# EAGLE design cp32m4 (EAGLE 9.2.1)
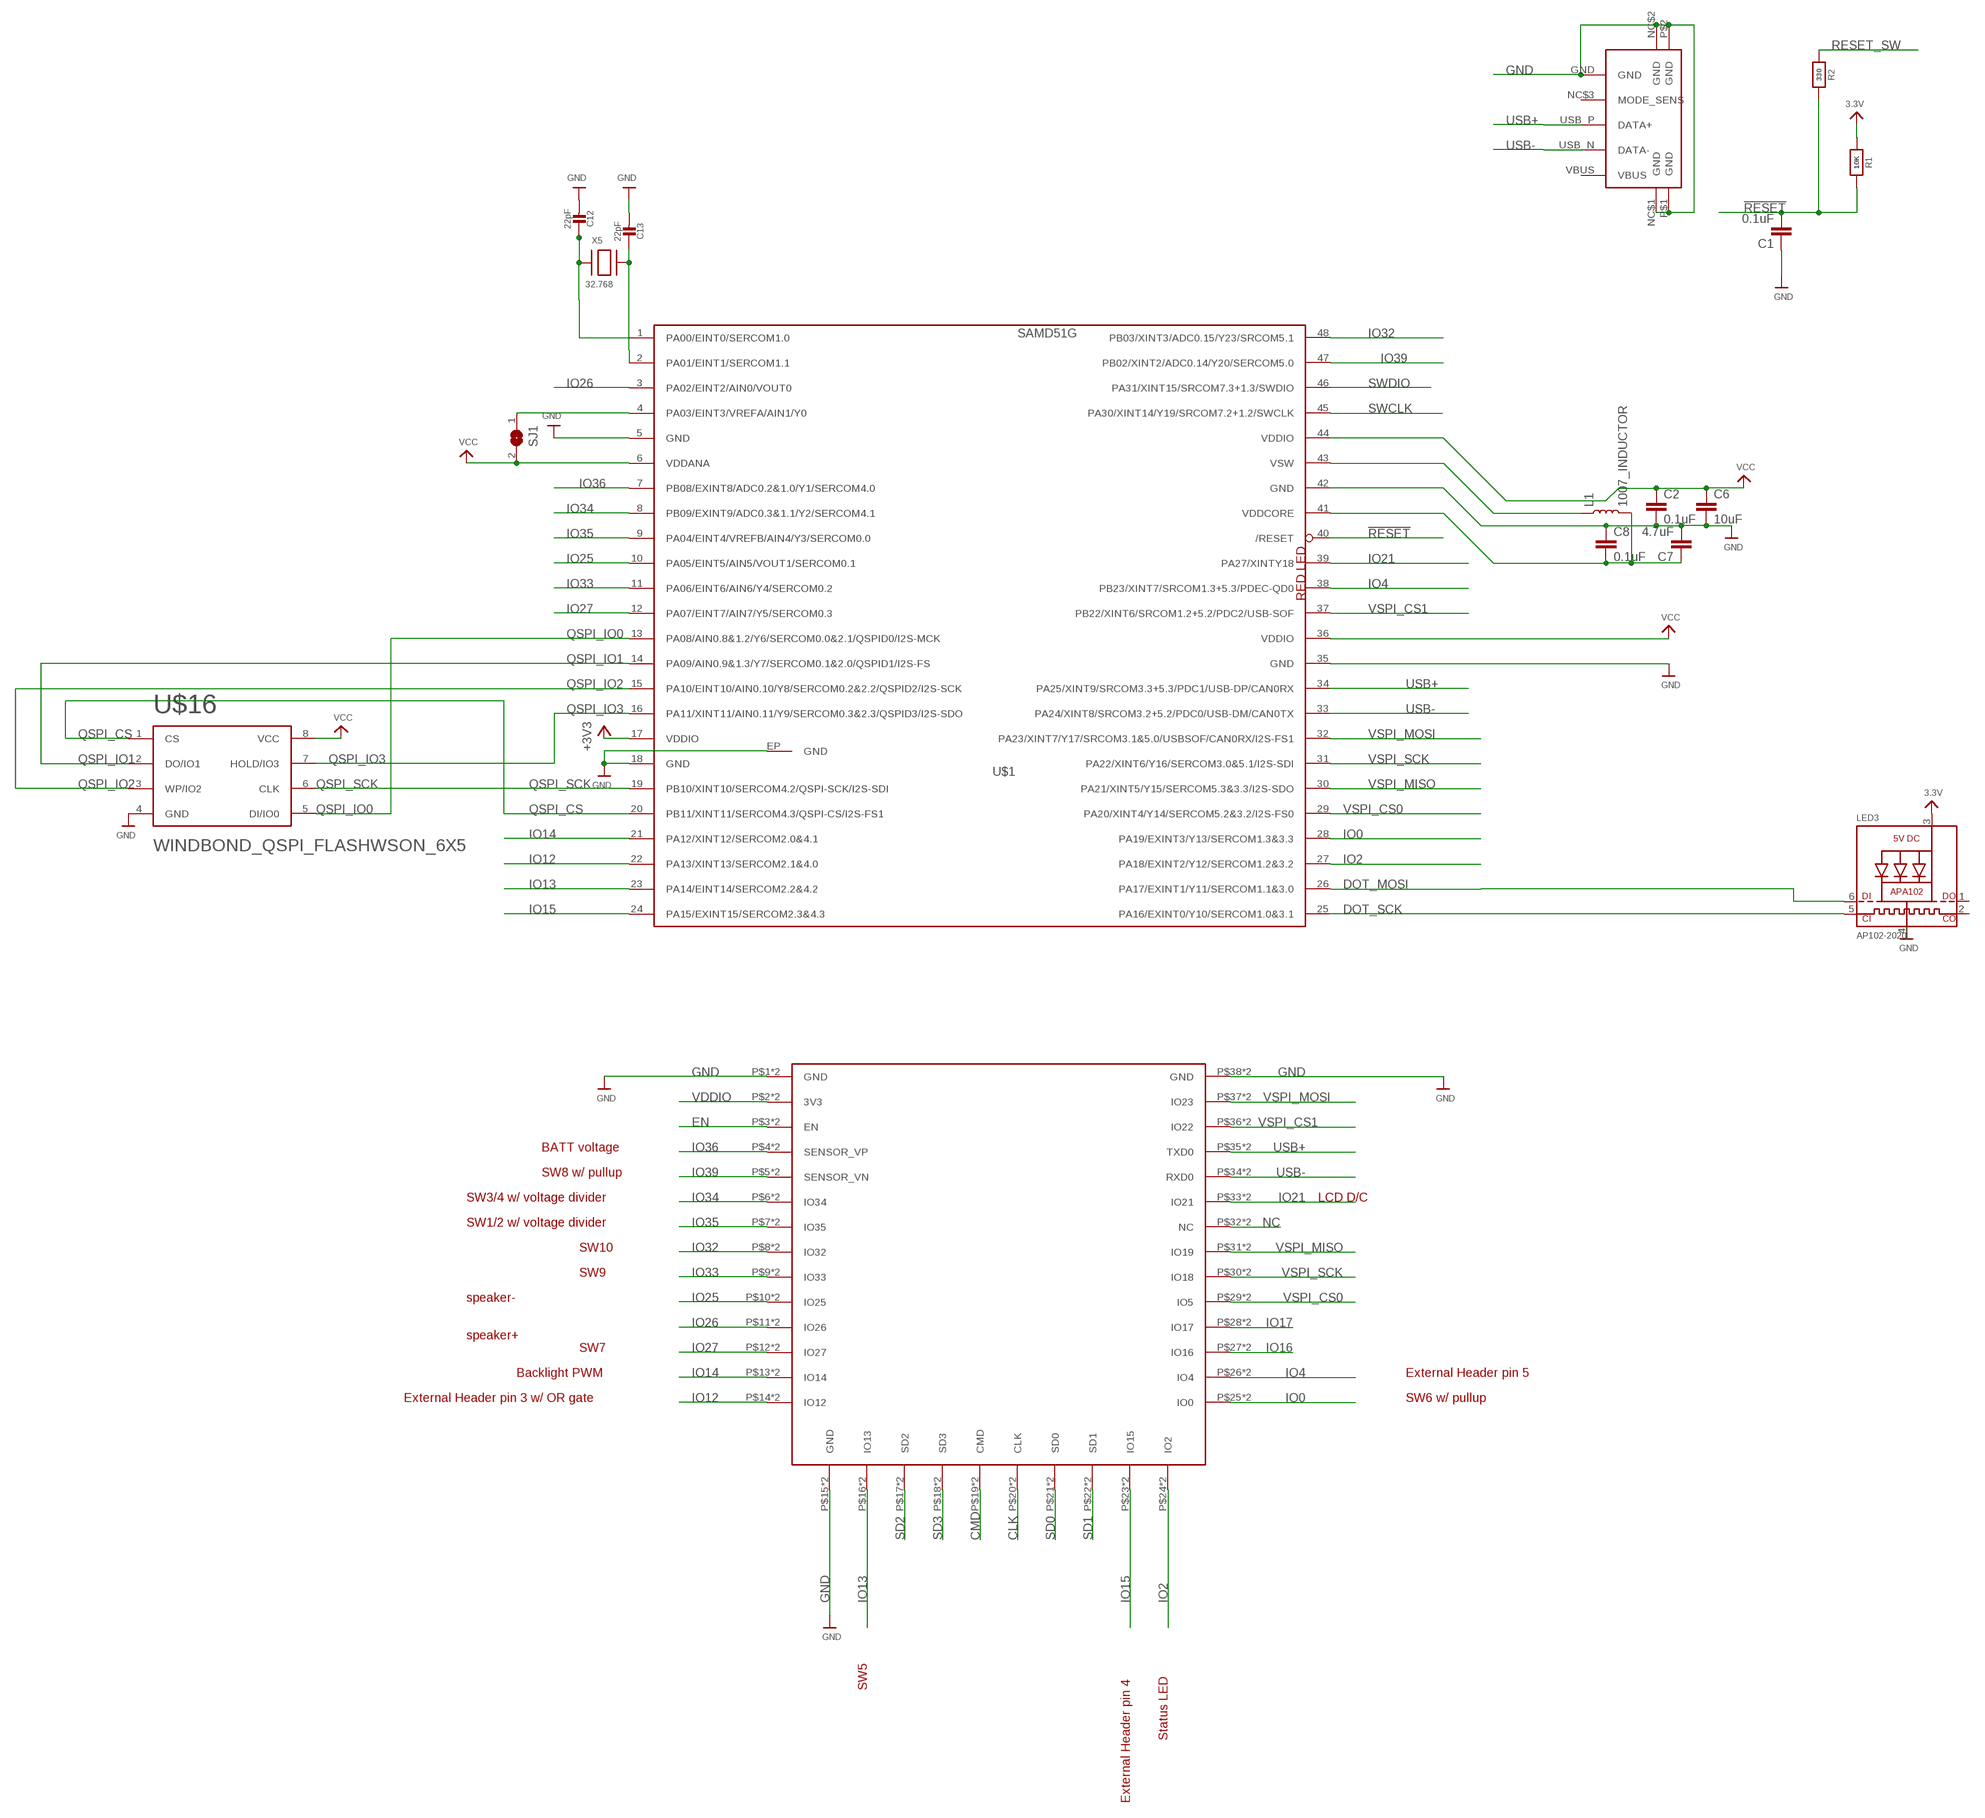
[diagram p0: schematic, sheet 1, part 1 of 2]
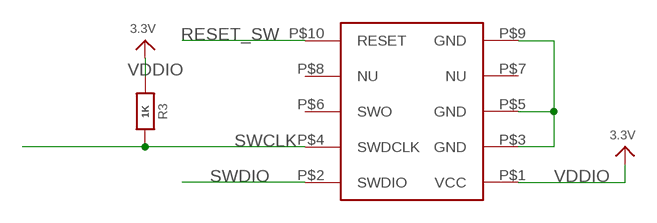
[diagram p1: schematic, sheet 1, part 2 of 2]

## Parts
C1  0.1uF  0.1UF-0603-25V-(+80/-20%)  [0603]
C2  0.1uF  0.1UF-0603-25V-(+80/-20%)  [0603]
C6  10uF  10UF-0805-10V-10%  [0805]
C7  4.7uF  4.7UF0603  [0603]
C8  0.1uF  0.1UF-0603-25V-(+80/-20%)  [0603]
C12  22pF  CAP_CERAMIC0603_NO  [0603-NO]
C13  22pF  CAP_CERAMIC0603_NO  [0603-NO]
L1  1007_INDUCTOR  [1007_INDUCTOR]
LED3  AP102-2020  APA1022020  [APA102_2020]
R1  10K  RESISTOR_0603_NOOUT  [0603-NO]
R2  330  RESISTOR_0603_NOOUT  [0603-NO]
R3  1K  RESISTOR_0603_NOOUT  [0603-NO]
SJ1  SOLDERJUMPERCLOSED  [SOLDERJUMPER_CLOSEDWIRE]
U$1  SAMD51G  [QFN-48]
U$2  SWD_HEADER  [AMPHENOL_SWD]
U$5  WROOM  [ESP32_WROOM]
U$16  WINDBOND_QSPI_FLASHWSON_6X5  [WSON_6X5MM]
U$19  AMPHENOL_MICRO_USBAMPHENOL_MICRO_USB_BETTER  [BETTER_AMP_MICRO_USB]
X5  32.768  XTAL-3.2X1.5  [XTAL3215]

## Nets
!RESET: C1.2 R1.1 R2.1 U$1.40(/RESET)
AREF: SJ1.1 U$1.4(PA03/EINT3/VREFA/AIN1/Y0)
CLK: U$5.P$20(CLK) U$5.PP$20(CLK)
CMD: U$5.P$19(CMD) U$5.PP$19(CMD)
DOT_MOSI: LED3.6(DI) U$1.26(PA17/EXINT1/Y11/SERCOM1.1&3.0)
DOT_SCK: LED3.5(CKI) U$1.25(PA16/EXINT0/Y10/SERCOM1.0&3.1)
EN: U$5.P$3(EN) U$5.PP$3(EN)
GND: C1.1 C2.2 C6.2 C7.2 C8.1 C12.2 C13.2 LED3.4(GND) U$1.5(GND) U$1.18(GND) U$1.35(GND) U$1.42(GND) U$1.EP(GND) U$2.P$3(GND) U$2.P$5(GND) U$2.P$9(GND) U$5.P$1(GND) U$5.P$15(GND) U$5.P$38(GND) U$5.PP$1(GND) U$5.PP$15(GND) U$5.PP$38(GND) U$16.4(GND) U$19.GND U$19.NC$1(GND) U$19.NC$2(GND) U$19.P$1(GND) U$19.P$2(GND)
IO0: U$1.28(PA19/EXINT3/Y13/SERCOM1.3&3.3) U$5.P$25(IO0) U$5.PP$25(IO0)
IO2: U$1.27(PA18/EXINT2/Y12/SERCOM1.2&3.2) U$5.P$24(IO2) U$5.PP$24(IO2)
IO4: U$1.38(PB23/XINT7/SRCOM1.3+5.3/PDEC-QD0) U$5.P$26(IO4) U$5.PP$26(IO4)
IO12: U$1.22(PA13/XINT13/SERCOM2.1&4.0) U$5.P$14(IO12) U$5.PP$14(IO12)
IO13: U$1.23(PA14/EINT14/SERCOM2.2&4.2) U$5.P$16(IO13) U$5.PP$16(IO13)
IO14: U$1.21(PA12/XINT12/SERCOM2.0&4.1) U$5.P$13(IO14) U$5.PP$13(IO14)
IO15: U$1.24(PA15/EXINT15/SERCOM2.3&4.3) U$5.P$23(IO15) U$5.PP$23(IO15)
IO16: U$5.P$27(IO16) U$5.PP$27(IO16)
IO17: U$5.P$28(IO17) U$5.PP$28(IO17)
IO21: U$1.39(PA27/XINTY18) U$5.P$33(IO21) U$5.PP$33(IO21)
IO25: U$1.10(PA05/EINT5/AIN5/VOUT1/SERCOM0.1) U$5.P$10(IO25) U$5.PP$10(IO25)
IO26: U$1.3(PA02/EINT2/AIN0/VOUT0) U$5.P$11(IO26) U$5.PP$11(IO26)
IO27: U$1.12(PA07/EINT7/AIN7/Y5/SERCOM0.3) U$5.P$12(IO27) U$5.PP$12(IO27)
IO32: U$1.48(PB03/XINT3/ADC0.15/Y23/SRCOM5.1) U$5.P$8(IO32) U$5.PP$8(IO32)
IO33: U$1.11(PA06/EINT6/AIN6/Y4/SERCOM0.2) U$5.P$9(IO33) U$5.PP$9(IO33)
IO34: U$1.8(PB09/EXINT9/ADC0.3&1.1/Y2/SERCOM4.1) U$5.P$6(IO34) U$5.PP$6(IO34)
IO35: U$1.9(PA04/EINT4/VREFB/AIN4/Y3/SERCOM0.0) U$5.P$7(IO35) U$5.PP$7(IO35)
IO36: U$1.7(PB08/EXINT8/ADC0.2&1.0/Y1/SERCOM4.0) U$5.P$4(SENSOR_VP) U$5.PP$4(SENSOR_VP)
IO39: U$1.47(PB02/XINT2/ADC0.14/Y20/SERCOM5.0) U$5.P$5(SENSOR_VN) U$5.PP$5(SENSOR_VN)
NC: U$5.P$32(NC) U$5.PP$32(NC)
QSPI_CS: U$1.20(PB11/XINT11/SERCOM4.3/QSPI-CS/I2S-FS1) U$16.1(CS)
QSPI_IO0: U$1.13(PA08/AIN0.8&1.2/Y6/SERCOM0.0&2.1/QSPID0/I2S-MCK) U$16.5(DI/IO0)
QSPI_IO1: U$1.14(PA09/AIN0.9&1.3/Y7/SERCOM0.1&2.0/QSPID1/I2S-FS) U$16.2(DO/IO1)
QSPI_IO2: U$1.15(PA10/EINT10/AIN0.10/Y8/SERCOM0.2&2.2/QSPID2/I2S-SCK) U$16.3(WP/IO2)
QSPI_IO3: U$1.16(PA11/XINT11/AIN0.11/Y9/SERCOM0.3&2.3/QSPID3/I2S-SDO) U$16.7(HOLD/IO3)
QSPI_SCK: U$1.19(PB10/XINT10/SERCOM4.2/QSPI-SCK/I2S-SDI) U$16.6(CLK)
RESET_SW: R2.2 U$2.P$10(RESET)
SD0: U$5.P$21(SD0) U$5.PP$21(SD0)
SD1: U$5.P$22(SD1) U$5.PP$22(SD1)
SD2: U$5.P$17(SD2) U$5.PP$17(SD2)
SD3: U$5.P$18(SD3) U$5.PP$18(SD3)
SWCLK: R3.1 U$1.45(PA30/XINT14/Y19/SRCOM7.2+1.2/SWCLK) U$2.P$4(SWDCLK)
SWDIO: U$1.46(PA31/XINT15/SRCOM7.3+1.3/SWDIO) U$2.P$2(SWDIO)
USB+: U$1.34(PA25/XINT9/SRCOM3.3+5.3/PDC1/USB-DP/CAN0RX) U$5.P$35(TXD0) U$5.PP$35(TXD0) U$19.USB_P(DATA+)
USB-: U$1.33(PA24/XINT8/SRCOM3.2+5.2/PDC0/USB-DM/CAN0TX) U$5.P$34(RXD0) U$5.PP$34(RXD0) U$19.USB_N(DATA-)
VDDCORE: C7.1 C8.2 L1.P$2 U$1.41(VDDCORE)
VDDIO: C2.1 C6.1 LED3.3(VDD) R1.2 R3.2 SJ1.2 U$1.6(VDDANA) U$1.17(VDDIO) U$1.36(VDDIO) U$1.44(VDDIO) U$2.P$1(VCC) U$5.P$2(3V3) U$5.PP$2(3V3) U$16.8(VCC) ; supply symbol labelled VCC, 3.3V, +3V3
VSPI_CS0: U$1.29(PA20/XINT4/Y14/SERCOM5.2&3.2/I2S-FS0) U$5.P$29(IO5) U$5.PP$29(IO5)
VSPI_CS1: U$1.37(PB22/XINT6/SRCOM1.2+5.2/PDC2/USB-SOF) U$5.P$36(IO22) U$5.PP$36(IO22)
VSPI_MISO: U$1.30(PA21/XINT5/Y15/SERCOM5.3&3.3/I2S-SDO) U$5.P$31(IO19) U$5.PP$31(IO19)
VSPI_MOSI: U$1.32(PA23/XINT7/Y17/SRCOM3.1&5.0/USBSOF/CAN0RX/I2S-FS1) U$5.P$37(IO23) U$5.PP$37(IO23)
VSPI_SCK: U$1.31(PA22/XINT6/Y16/SERCOM3.0&5.1/I2S-SDI) U$5.P$30(IO18) U$5.PP$30(IO18)
VSW: L1.P$1 U$1.43(VSW)
XOSC32_A: C12.1 U$1.1(PA00/EINT0/SERCOM1.0) X5.P$1
XOSC32_B: C13.1 U$1.2(PA01/EINT1/SERCOM1.1) X5.P$2
Unconnected: LED3.1(DO) LED3.2(CKO) U$2.P$6(SWO) U$2.P$7(NU) U$2.P$8(NU) U$19.NC$3(MODE_SENS) U$19.VBUS

## Notes on the sheet
- Dev Board Starter Kit
- RED LED
- BATT voltage
- SW8 w/ pullup
- SW3/4 w/ voltage divider | LCD D/C
- SW1/2 w/ voltage divider
- SW10
- SW9
- speaker-
- speaker+
- SW7
- Backlight PWM | External Header pin 5
- External Header pin 3 w/ OR gate | SW6 w/ pullup
- SW5
- Status LED
- External Header pin 4

## Library data of the parts
C1 C2 C8 = SparkFun-Capacitors:0.1UF: 0.1µF ceramic capacitors A capacitor is a passive two-terminal electrical component used to store electrical energy temporarily in an electric field.; PROD_ID: CAP-00810
C6 = SparkFun-Capacitors:10UF: 10.0µF ceramic capacitors A capacitor is a passive two-terminal electrical component used to store electrical energy temporarily in an electric field.; PROD_ID: CAP-11330
C7 = SparkFun-Capacitors:4.7UF: 4.7µF ceramic capacitors A capacitor is a passive two-terminal electrical component used to store electrical energy temporarily in an electric field.; PROD_ID: CAP-08280
C12 C13 = microbuilder:CAP_CERAMIC: Ceramic Capacitors For new designs, use the packages preceded by an '_' character since they are more reliable: The following footprints should be used on most boards: _0402 - Standard footprint for regular board layouts _0603 - Standard footprint for regular board layouts _0805 - Standard footprint for regular board layouts _1206 - Standard footprint for regular board layouts For extremely tight-pitch boards where space is at a premium, the following 'micro-pitch' footprints can be used (smaller pads, no silkscreen outline, etc.): _0402MP - Micro-pitch footprint for very dense/compact boards _0603MP - Micro-pitch footprint for very dense/compact boards _0805MP - Micro-pitch footprint for very dense/compact boards _1206MP - Micro-pitch footprint for very dense/compact boards
L1 = 00_bsiepert:1007_INDUCTOR
LED3 = microbuilder:APA102: APA102/DotStar Pixels VCC: 5V DC Refresh Rate: 400Hz
R1-R3 = microbuilder:RESISTOR: Resistors For new designs, use the packages preceded by an '_' character since they are more reliable: The following footprints should be used on most boards: _0402 - Standard footprint for regular board layouts _0603 - Standard footprint for regular board layouts _0805 - Standard footprint for regular board layouts _1206 - Standard footprint for regular board layouts For extremely tight-pitch boards where space is at a premium, the following 'micro-pitch' footprints can be used (smaller pads, no silkscreen outline, etc.): _0402MP - Micro-pitch footprint for very dense/compact boards _0603MP - Micro-pitch footprint for very dense/compact boards _0805MP - Micro-pitch footprint for very dense/compact boards _1206MP - Micro-pitch footprint for very dense/compact boards
SJ1 = 00_bsiepert:SOLDERJUMPER: SMD Solder JUMPER Solder the two pads together to create a connection, or remove the solder to break it. REFLOW - Use this footprint for solder paste and reflow ovens. WAVE - Use this footprint for hand-soldering (larger pads). CLOSED - Has a trace between the two pads to ensure it is closed by default. The trace needs to be cut to disable the jumper, and can be closed again by creating a solder bridge between the two pads.
U$1 = 00_bsiepert:SAMD51G
U$2 = 00_bsiepert:SWD_HEADER
U$5 = 00_bsiepert:WROOM
U$16 = 00_bsiepert:WINDBOND_QSPI_FLASH
U$19 = 00_bsiepert:AMPHENOL_MICRO_USB
X5 = adafruit2:XTAL: Low cost SMT crystals, no capacitors included http://www.ladyada.net/library/eagle

## Board
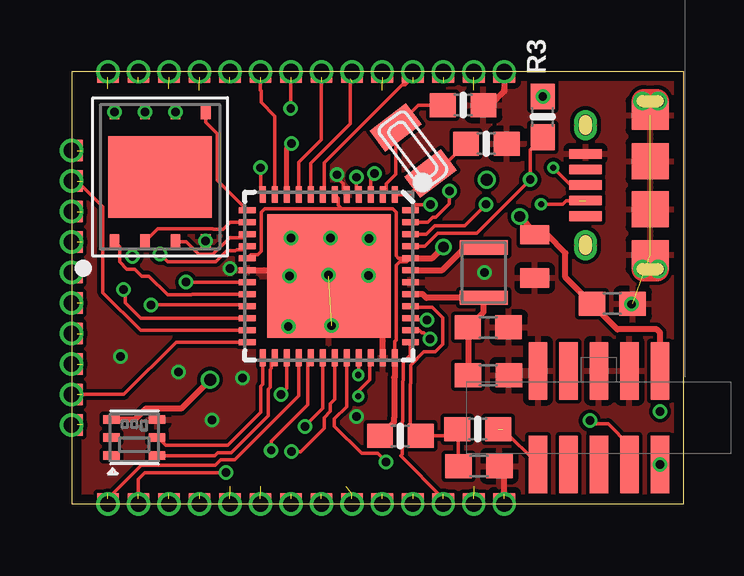
[diagram p2: board, top side]
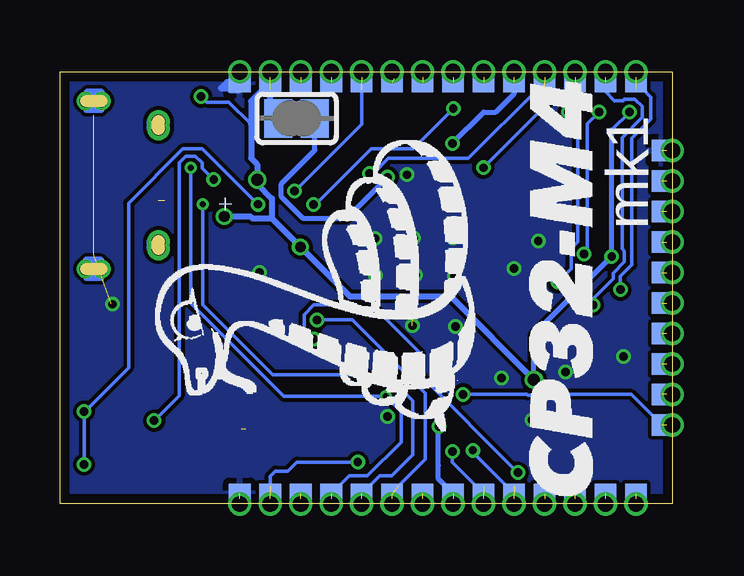
[diagram p3: board, bottom side, seen from below]

Size 25.51 x 18 mm. Coordinates in mm from the lower left corner, seen from the top.
Outline: 0,16.6 0,12.03
Copper layers (1*16): Top 0.035559375mm / dielectric 1.6mm / Bottom 0.035559375mm
Design rules "oshpark-2layer-tented": minimum track width 6mil, minimum drill 10mil, track to track 6mil, track to pad 6mil, pad to pad 6mil, via to via 6mil, smd to smd 6mil, copper to edge 15mil, drill to drill 6mil, minimum pad ring 5mil, minimum via ring 5mil, stop-mask expansion 2.5mil, vias tented up to drill 20mil, thermal gap 10mil

### Footprints (pad centres in the part's own frame; a part is rotated, then mirrored left to right if it is on the bottom)
0603 = smd 1.1 x 1: 1 -0.85,0; 2 0.85,0
0805 = smd 0.8 x 1.2: 1 -0.9,0; 2 0.9,0
0603-NO = smd 1.075 x 1: 1 -0.85,0; 2 0.85,0
1007_INDUCTOR = smd 0.6 x 2: P$1 -1.05,0; P$2 1.05,0
APA102_2020 = smd 0.7 x 0.35: 1 -0.95,-0.75; 2 -0.95,0; 3 -0.95,0.75; 4 0.95,0.75; 5 0.95,0; 6 0.95,-0.75
SOLDERJUMPER_CLOSEDWIRE = smd 1.168 x 1.6: 1 -0.762,0; 2 0.762,0 | smd 0.635 x 0.203: WIRE 0,0
QFN-48 = smd 0.7 x 0.25: 1 -3.4,2.75; 2 -3.4,2.25; 3 -3.4,1.75; 4 -3.4,1.25; 5 -3.4,0.75; 6 -3.4,0.25; 7 -3.4,-0.25; 8 -3.4,-0.75; 9 -3.4,-1.25; 10 -3.4,-1.75; 11 -3.4,-2.25; 12 -3.4,-2.75; 25 3.4,-2.75; 26 3.4,-2.25; 27 3.4,-1.75; 28 3.4,-1.25; 29 3.4,-0.75; 30 3.4,-0.25; 31 3.4,0.25; 32 3.4,0.75; 33 3.4,1.25; 34 3.4,1.75; 35 3.4,2.25; 36 3.4,2.75 | smd 0.25 x 0.7: 13 -2.75,-3.4; 14 -2.25,-3.4; 15 -1.75,-3.4; 16 -1.25,-3.4; 17 -0.75,-3.4; 18 -0.25,-3.4; 19 0.25,-3.4; 20 0.75,-3.4; 21 1.25,-3.4; 22 1.75,-3.4; 23 2.25,-3.4; 24 2.75,-3.4; 37 2.75,3.4; 38 2.25,3.4; 39 1.75,3.4; 40 1.25,3.4; 41 0.75,3.4; 42 0.25,3.4; 43 -0.25,3.4; 44 -0.75,3.4; 45 -1.25,3.4; 46 -1.75,3.4; 47 -2.25,3.4; 48 -2.75,3.4 | smd 5.15 x 5.15: EP 0,0
AMPHENOL_SWD = smd 0.76 x 2.4: P$1 -2.54,-1.95; P$2 -2.54,1.95; P$3 -1.27,-1.95; P$4 -1.27,1.95; P$5 0,-1.95; P$6 0,1.95; P$7 1.27,-1.95; P$8 1.27,1.95; P$9 2.54,-1.95; P$10 2.54,1.95
ESP32_WROOM = smd 0.45 x 0.9: P$1 -8.775,9.01; P$2 -8.775,7.74; P$3 -8.775,6.47; P$4 -8.775,5.2; P$5 -8.775,3.93; P$6 -8.775,2.66; P$7 -8.775,1.39; P$8 -8.775,0.12; P$9 -8.775,-1.15; P$10 -8.775,-2.42; P$11 -8.775,-3.69; P$12 -8.775,-4.96; P$13 -8.775,-6.23; P$14 -8.775,-7.5; P$25 8.775,-7.5; P$26 8.775,-6.23; P$27 8.775,-4.96; P$28 8.775,-3.69; P$29 8.775,-2.42; P$30 8.775,-1.15; P$31 8.775,0.12; P$32 8.775,1.39; P$33 8.775,2.66; P$34 8.775,3.93; P$35 8.775,5.2; P$36 8.775,6.47; P$37 8.775,7.74; P$38 8.775,9.01 | smd 0.9 x 0.45: P$15 -5.72,-8.775; P$16 -4.45,-8.775; P$17 -3.18,-8.775; P$18 -1.91,-8.775; P$19 -0.64,-8.775; P$20 0.63,-8.775; P$21 1.9,-8.775; P$22 3.17,-8.775; P$23 4.44,-8.775; P$24 5.71,-8.775 | drill 0.65 pad 0.904: P$39 -9.009,9.01; P$40 -9.009,7.74; P$41 -9.009,6.47; P$42 -9.009,5.2; P$43 -9.009,3.93; P$44 -9.009,2.66; P$45 -9.009,1.39; P$46 -9.009,0.12; P$47 -9.009,-1.15; P$48 -9.009,-2.42; P$49 -9.009,-3.69; P$50 -9.009,-4.96; P$51 -9.009,-6.23; P$52 -9.009,-7.5; P$53 -5.72,-9.011; P$54 -4.45,-9.011; P$55 -3.18,-9.011; P$56 -1.91,-9.011; P$57 -0.64,-9.011; P$58 0.63,-9.011; P$59 1.9,-9.011; P$60 3.17,-9.011; P$61 4.44,-9.011; P$62 5.71,-9.011; P$63 9.009,-7.5; P$64 9.009,-6.23; P$65 9.009,-4.96; P$66 9.009,-3.69; P$67 9.009,-2.42; P$68 9.009,-1.15; P$69 9.009,0.12; P$70 9.009,1.39; P$71 9.009,2.66; P$72 9.009,3.93; P$73 9.009,5.2; P$74 9.009,6.47; P$75 9.009,7.74; P$76 9.009,9.01 | smd 0.85 x 0.9 bottom: PP$1 -8.575,9.01; PP$2 -8.575,7.74; PP$3 -8.575,6.47; PP$4 -8.575,5.2; PP$5 -8.575,3.93; PP$6 -8.575,2.66; PP$7 -8.575,1.39; PP$8 -8.575,0.12; PP$9 -8.575,-1.15; PP$10 -8.575,-2.42; PP$11 -8.575,-3.69; PP$12 -8.575,-4.96; PP$13 -8.575,-6.23; PP$14 -8.575,-7.5; PP$25 8.575,-7.5; PP$26 8.575,-6.23; PP$27 8.575,-4.96; PP$28 8.575,-3.69; PP$29 8.575,-2.42; PP$30 8.575,-1.15; PP$31 8.575,0.12; PP$32 8.575,1.39; PP$33 8.575,2.66; PP$34 8.575,3.93; PP$35 8.575,5.2; PP$36 8.575,6.47; PP$37 8.575,7.74; PP$38 8.575,9.01 | smd 0.9 x 0.85 bottom: PP$15 -5.72,-8.575; PP$16 -4.45,-8.575; PP$17 -3.18,-8.575; PP$18 -1.91,-8.575; PP$19 -0.64,-8.575; PP$20 0.63,-8.575; PP$21 1.9,-8.575; PP$22 3.17,-8.575; PP$23 4.44,-8.575; PP$24 5.71,-8.575
WSON_6X5MM = smd 0.6 x 0.4: 1 -2.7,1.905; 2 -2.7,0.635; 3 -2.7,-0.635; 4 -2.7,-1.905; 5 2.7,-1.905; 6 2.7,-0.635; 7 2.7,0.635; 8 2.7,1.905 | smd 3.4 x 4.3: PAD 0,0
BETTER_AMP_MICRO_USB = smd 0.4 x 1.35: GND 1.3,2.7; NC$3 0.65,2.7; USB_N -0.65,2.7; USB_P 0,2.7; VBUS -1.3,2.7 | smd 1.5 x 1.55: NC$1 -1,0; NC$2 1,0 | smd 1.2 x 1.55: P$1 -2.9,0; P$2 2.9,0 | drill 0.5: P$3 -3.5,0.325; P$4 -3.5,-0.325; P$5 3.5,-0.325; P$6 3.5,0.325 | drill 0.55 pad 0.95: P$7 -2.65,2.7; P$8 -2.35,2.7; P$9 2.35,2.7; P$10 2.65,2.7
XTAL3215 = smd 1.1 x 1.9: P$1 1.2,0; P$2 -1.2,0

### Placement (x,y rotation side)
C1  16.98,1.58 180 top
C2  22.53,8.34 0 top
C6  19.3,10.31 270 top
C7  17.36,7.35 0 top
C8  17.37,5.37 180 top
C12  17.28,15.01 0 top
C13  16.31,16.62 0 top
L1  17.16,9.64 270 top
LED3  2.61,2.77 0 top
R1  13.7,2.83 180 top
R2  16.92,3.12 0 top
R3  19.63,16.12 90 top
SJ1  15.66,16.06 180 bottom
U$1  10.72,9.49 270 top
U$2  21.97,3.59 180 top
U$5  9.01,9 270 top
U$16  3.69,13.63 90 top
U$19  24.11,13.29 90 top
X5  14.23,14.73 307 top

### Tracks (layer width: path | path; a pad name or v marks a point on that pad's centre or on a via)
!RESET  (1 unrouted)
  Top 0.152: C1.2 16.11,1.56 16.11,3.08 R2.1 | 15.87,3.32 R2.1 | 14.16,8.2 15.03,8.2 15.47,7.75 15.47,6.64 15.16,6.33 14.68,6.33 14.13,5.78 14.13,5.02 14.1,4.99 14.1,3.28 R1.1 15.78,2.83 R2.1 | 14.15,8.21 U$1.40
AREF  (via drill 0.35)
  Top 0.152: U$1.4 11.86,12.99 v11.86,13.61
  Bottom 0.203: SJ1.1 14.89,14.74 16.29,13.34 16.29,12.81 15.37,11.88 13.59,11.88 v11.86,13.61
CLK  (1 unrouted)
CMD  (1 unrouted)
DOT_MOSI
  Top 0.152: U$1.26 8.32,5.94 8.32,5.65 8.27,5.6 8.27,4.87 8.19,4.78 8.19,3.67 6.65,2.14 6.09,2.14 5.97,2.02 LED3.6
DOT_SCK
  Top 0.152: LED3.5 3.6,2.77 3.92,2.44 6.52,2.44 7.88,3.81 7.88,4.91 7.97,5 U$1.25
EN  (1 unrouted)
GND  (via drill 0.35)  (7 unrouted)
  Top 0.152: U$1.5 11.32,13.04 11.32,13.34 11.06,13.59 v11.06,13.72
  Top 0.254: 18.02,17.19 17.45,16.62 C13.2 | U$5.P$38 18.02,1.38 C1.1 | U$1.35 12.97,7.28 v10.71,9.54 10.51,9.74 U$1.18 | 18.02,17.19 18.02,17.24 18.02,17.19 | U$5.P$1 18.02,17.19
  Bottom 0.254: U$5.PP$1 18.55,17.57 18.8,17.32 18.81,17.32 18.51,17.32 18.43,17.24 18.02,17.24
  other vias: 5.85,3.5 9.14,11.08 10.78,11.07 12.39,11.07 12.38,9.52 9.08,9.49 9.03,7.4 10.83,7.43 2.03,6.13 4.45,5.5 7.11,5.25 6.6,9.81 5.59,10.96 11.87,3.65 17.2,9.65 23.34,8.32
  pour Top: 0.05,18.09 25.64,18.09 25.64,-0.16 0.05,-0.16
  pour Bottom: 26.24,18.75 26.24,-0.48 -0.66,-0.48 -0.66,18.74
IO0  (1 unrouted)
  Top 0.152: U$1.28 9.47,4.5 6.8,1.83 6.22,1.83 5.99,1.61 2.9,1.61 U$5.P$25
IO2  (via drill 0.35)  (1 unrouted)
  Top 0.152: v8.72,4.56 8.97,4.81 U$1.27
  Bottom 0.152: U$5.PP$24 1.71,4.56 5.47,4.56 5.5,4.54 6.03,4.54 6.06,4.56 v8.72,4.56
IO4  (via drill 0.35)  (1 unrouted)
  Top 0.152: U$5.P$26 2.78,1.03 3.06,1.3 v6.44,1.3 | U$1.38 14.48,7.24 14.59,7.14 14.67,7.14 v14.94,6.86
  Bottom 0.152: v6.44,1.3 10.49,5.36 10.49,6.01 10.49,6.26 12.32,8.09 13.23,8.09 13.42,8.29 14.94,8.29 15.34,7.89 15.34,7.26 v14.94,6.86
IO12  (via drill 0.35)  (2 unrouted)
  Top 0.152: v2.16,8.93 2.23,8.86 2.23,8.39 2.88,7.74 U$1.22
  Bottom 0.152: v2.16,8.93 2.16,9.49 1.69,9.96 1.69,12.99 1.69,15.24 0.95,15.98 0.95,15.99 0.89,16.04 0.89,16.95 1.23,17.29 1.51,17.29
IO13  (1 unrouted)
  Top 0.152: 0.25,13.46 U$5.P$16 1.31,12.38 1.31,8.81 2.87,7.24 U$1.23
IO14  (via drill 0.35)  (1 unrouted)
  Top 0.152: v3.3,8.29 7.26,8.29 U$1.21
  Bottom 0.152: U$5.PP$13 2.78,17.17 2.42,16.8 2.06,16.8 2,16.86 1.56,16.86 1.26,16.56 | 1.25,16.55 1.26,16.56 | v3.3,8.29 3.3,8.55 2.47,9.39 2.47,9.62 2,10.09 2,10.53 2.09,10.63 2.09,15.26 1.25,16.11 1.25,16.55 | 1.25,16.55 1.26,16.56
IO15  (1 unrouted)
  Top 0.152: U$5.P$23 2.18,4.56 4.36,6.74 U$1.24
IO16  (1 unrouted)
IO17  (1 unrouted)
IO21  (via drill 0.35)  (2 unrouted)
  Top 0.152: U$1.39 14.19,7.67 v14.81,7.67
  Bottom 0.152: 11.42,0.73 10.29,1.86 10.29,4.62 13.34,7.67 v14.81,7.67
IO25  (via drill 0.35)  (1 unrouted)
  Top 0.2: U$1.10 8.97,14.82 v9.17,15.02
  Bottom 0.2: v9.17,15.02 7.87,16.32 7.36,16.32 6.59,17.09 6.59,17.22
  Bottom 0.203: U$5.PP$10 6.59,17.09
IO26  (via drill 0.35)  (2 unrouted)
  Top 0.152: U$1.3 12.47,13.61 v12.62,13.76
  Bottom 0.152: 5.32,17.24 5.66,17.24 8.5,14.39 11.83,14.39 12.46,13.76 v12.62,13.76
IO27  (via drill 0.35)  (2 unrouted)
  Top 0.152: U$1.12 7.88,12.98 v7.88,14.01
  Bottom 0.152: v7.88,14.01 4.96,16.92 4.78,16.92 4.41,17.29 4.05,17.29
IO32  (via drill 0.35)  (1 unrouted)
  Top 0.152: 9.13,17.24 9.13,16.68 | 9.13,16.68 v9.13,16.47 | v14.95,12.47 14.34,12.47 U$1.48 | U$5.P$8 9.13,16.68
  Bottom 0.152: v14.95,12.47 14.88,12.47 12.55,14.81 10.79,14.81 v9.13,16.47
IO33  (1 unrouted)
  Top 0.152: U$1.11 8.47,16.16 7.89,16.74 7.89,17.22 7.86,17.24 U$5.P$9
IO34  (1 unrouted)
  Top 0.152: U$1.8 9.97,14.2 11.61,15.84 11.61,17.71 U$5.P$6
IO35  (1 unrouted)
  Top 0.152: U$1.9 9.47,14.24 10.4,15.18 U$5.P$7
IO36  (1 unrouted)
  Top 0.152: U$5.P$4 13.91,17.47 13.78,17.47 10.53,14.22 10.53,12.96 U$1.7
IO39  (via drill 0.35)  (2 unrouted)
  Top 0.152: U$1.47 14.85,11.74 15.05,11.94 15.17,11.94 15.74,12.51 v15.74,13.04
  Bottom 0.152: 12.94,17.24 12.94,15.83 v15.74,13.04
N$3
  Bottom 0.152: 23.96,10.06 24.2,10.06
N$5
  Bottom 0.152: 23.9,9.57 23.93,9.54 24.23,9.54
N$6
  Bottom 0.152: 23.99,16.52 24.2,16.52
N$7
  Bottom 0.152: 23.93,17.07 24.2,17.07
NC  (1 unrouted)
QSPI_CS
  Top 0.152: U$1.20 5.02,8.74 4.99,8.71 4,8.71 3.22,9.48 2.92,9.48 2.63,9.78 2.31,9.78 2,10.09 2,10.71 U$16.1
QSPI_IO0
  Top 0.152: U$1.13 6.06,13.49 6.06,15.42 5.59,15.9 U$16.5
QSPI_IO1
  Top 0.152: U$1.14 6.61,11.74 6.31,11.44 5.9,11.44 5.89,11.46 3.58,11.46 U$16.2
QSPI_IO2
  Top 0.152: U$1.15 7.17,11.09 6.58,11.09 5.89,10.4 5.3,10.4 4.77,10.93 U$16.3
QSPI_IO3  (via drill 0.35)
  Top 0.152: U$1.16 7.17,10.59 6.87,10.59 6.82,10.55 6.46,10.55 6.01,10.09 4.01,10.09 v3.69,10.42
  Bottom 0.152: U$16.7 3.54,15.84 3.54,10.57 v3.69,10.42
  other vias: 3.05,16.33
QSPI_SCK  (via drill 0.35)
  Top 0.152: U$1.19 v4.77,9.24
  Bottom 0.152: U$16.6 3.94,15.95 3.94,10.92 4.22,10.64 4.22,9.79 v4.77,9.24
  other vias: 4.32,16.33
RESET_SW  (1 unrouted)
  Top 0.152: U$2.P$10 17.96,3.12
SD0  (1 unrouted)
SD1  (1 unrouted)
SD2  (1 unrouted)
SD3  (1 unrouted)
SWCLK  (via drill 0.35)
  Top 0.152: v21.59,3.47 21.72,3.34 22.35,3.34 23.24,2.45 U$2.P$4 | U$1.45 14.71,10.74 15.26,11.29 16.89,11.29 v19.11,13.51 19.11,14.75 R3.1
  Bottom 0.152: v19.11,13.51 19.59,13.99 19.59,14.21 19.87,14.49 20.27,14.49 20.55,14.21 20.55,4.51 v21.59,3.47
SWDIO  (via drill 0.35)
  Top 0.152: v17.27,12.48 16.37,11.59 15.13,11.59 14.78,11.24 U$1.46
  Bottom 0.152: v17.27,12.48 19.58,14.8 20.39,14.8 22.65,12.54 22.65,5.68 24.48,3.85 v24.51,3.85 24.51,1.76 | 24.51,1.76 24.54,1.74 | 24.51,1.76 U$2.P$2
  other vias: 24.51,1.64
USB+  (via drill 0.25)  (1 unrouted)
  Top 0.152: v11.94,4.48 11.94,4.69 12.42,5.17 12.42,6.05 U$1.34 | v20.07,14.01 20.79,13.29 U$19.USB_P
  Bottom 0.152: v20.07,14.01 20.07,10.79 20.07,8.37 16.18,4.48 v11.94,4.48 11.31,3.85 11.31,2.58 12.7,1.18 13.46,1.18 U$5.PP$35
USB-  (via drill 0.25)  (2 unrouted)
  Top 0.152: U$1.33 11.97,5.4 v11.94,5.37 | 21.16,12.64 20.61,12.64 20.45,12.48 v19.56,12.48
  Bottom 0.152: v19.56,12.48 19.56,8.29 16.64,5.37 v11.94,5.37 11.89,5.37 10.82,4.3 10.82,2.05 11.69,1.18 12.19,1.18 U$5.PP$34
VDDCORE
  Top 0.254: C8.2 16.52,7.34 C7.1 17.16,8.01 L1.P$2 14.78,8.59 14.63,8.74 U$1.41
VDDIO  (via drill 0.35, 0.45, 0.5)  (2 unrouted)
  Top 0.152: U$1.6 11.11,12.74 11.11,12.45 11.26,12.29 | 11.26,12.29 13.39,12.29 13.52,12.16 13.52,10.34 13.62,10.24 U$1.44 13.97,10.1 13.67,10.1 13.52,9.94 13.52,6.82 13.47,6.77 U$1.36 | U$1.17 7.46,10.39 7.76,10.39 7.89,10.52 7.89,12.14 8.05,12.29 11.26,12.29
  Top 0.254: 19.3,11.41 C6.1 | LED3.3 2.64,3.52 3.09,3.97 4.56,3.97 v5.77,5.18 | U$1.44 15.03,10.24 v15.5,10.71 | R1.2 13.42,3.41 13.42,3.57 13.44,3.59 13.44,5.27 13.47,5.29 U$1.36 | v18.67,11.98 19.3,11.35 C6.1 | C6.1 19.82,11.21 20.58,10.45 20.58,9.44 C2.1 22.74,7.28 24.39,7.28 24.51,7.15 U$2.P$1
  Bottom 0.152: 2.53,15.58 U$16.8 | 17.55,15.82 18.48,16.74 19.4,16.74 R3.2
  Bottom 0.203: 2.53,15.58 v2.53,10.31 5.77,7.07 v5.77,5.18
  Bottom 0.254: U$5.PP$2 17.55,16.78 17.55,15.82 17.55,14.4 17.3,14.15 v17.3,13.51 | v5.77,5.18 9.24,8.65 13.44,8.65 v15.5,10.71 16.69,11.9 | v17.3,13.51 17.3,13.34 16.69,12.73 16.69,11.9 | v17.3,13.51 17.3,13.35 | v18.67,11.98 17.58,11.98 17.51,11.9 16.69,11.9 | SJ1.2 16.75,16.4 16.75,17.24
  other vias: 1.78,16.33 19.63,16.97
VSPI_CS0  (via drill 0.35)  (2 unrouted)
  Top 0.152: v8.32,2.24 8.32,2.62 9.84,4.14 9.84,5.96 U$1.29
  Bottom 0.152: v8.32,2.24 8.32,2.15 6.9,0.73 6.59,0.73
VSPI_CS1  (1 unrouted)
  Top 0.152: U$5.P$36 13.71,2 13.78,2.08 13.78,3.43 13.79,3.44 13.79,5.12 13.82,5.14 13.82,5.91 14.12,6.2 U$1.37
VSPI_MISO  (via drill 0.35)  (1 unrouted)
  Top 0.152: 10.48,6.08 U$1.30 10.47,3.98 v9.72,3.23
  Bottom 0.2: 9.75,1.6 9.75,3.2 v9.72,3.23
  Bottom 0.203: U$5.PP$31 9.75,1.04 9.75,1.6
VSPI_MOSI  (via drill 0.35)  (2 unrouted)
  Top 0.152: U$1.32 11.47,5.58 11.46,5.57 11.46,5.17 11.47,5.16 11.47,4.06 10.95,3.54 10.95,3.24 12.09,2.1 12.75,2.1 v13.11,1.74
  Bottom 0.152: 16.75,0.73 16.75,1.15 16.54,1.36 16.03,1.36 15.65,1.74 v13.11,1.74
VSPI_SCK  (via drill 0.35)  (2 unrouted)
  Top 0.152: U$1.31 10.97,4.37 10.77,4.17 10.77,3.85 10.52,3.6 10.52,3.15 9.55,2.18 v9.17,2.18
  Bottom 0.152: v9.17,2.18 9.17,1.73 8.17,0.73 7.86,0.73
VSW
  Top 0.254: U$1.43 15.45,9.74 16.4,10.69 L1.P$1
XOSC32_A
  Top 0.152: C12.1 15.19,13.77 X5.P$1 14.07,12.89 U$1.1
XOSC32_B
  Top 0.152: C13.1 14.44,16.62 X5.P$2 13.5,13.73 13.11,13.34 13.11,13.04 U$1.2

### Text on the board
bPlace: mk1